# EAGLE design board (EAGLE 5.11)
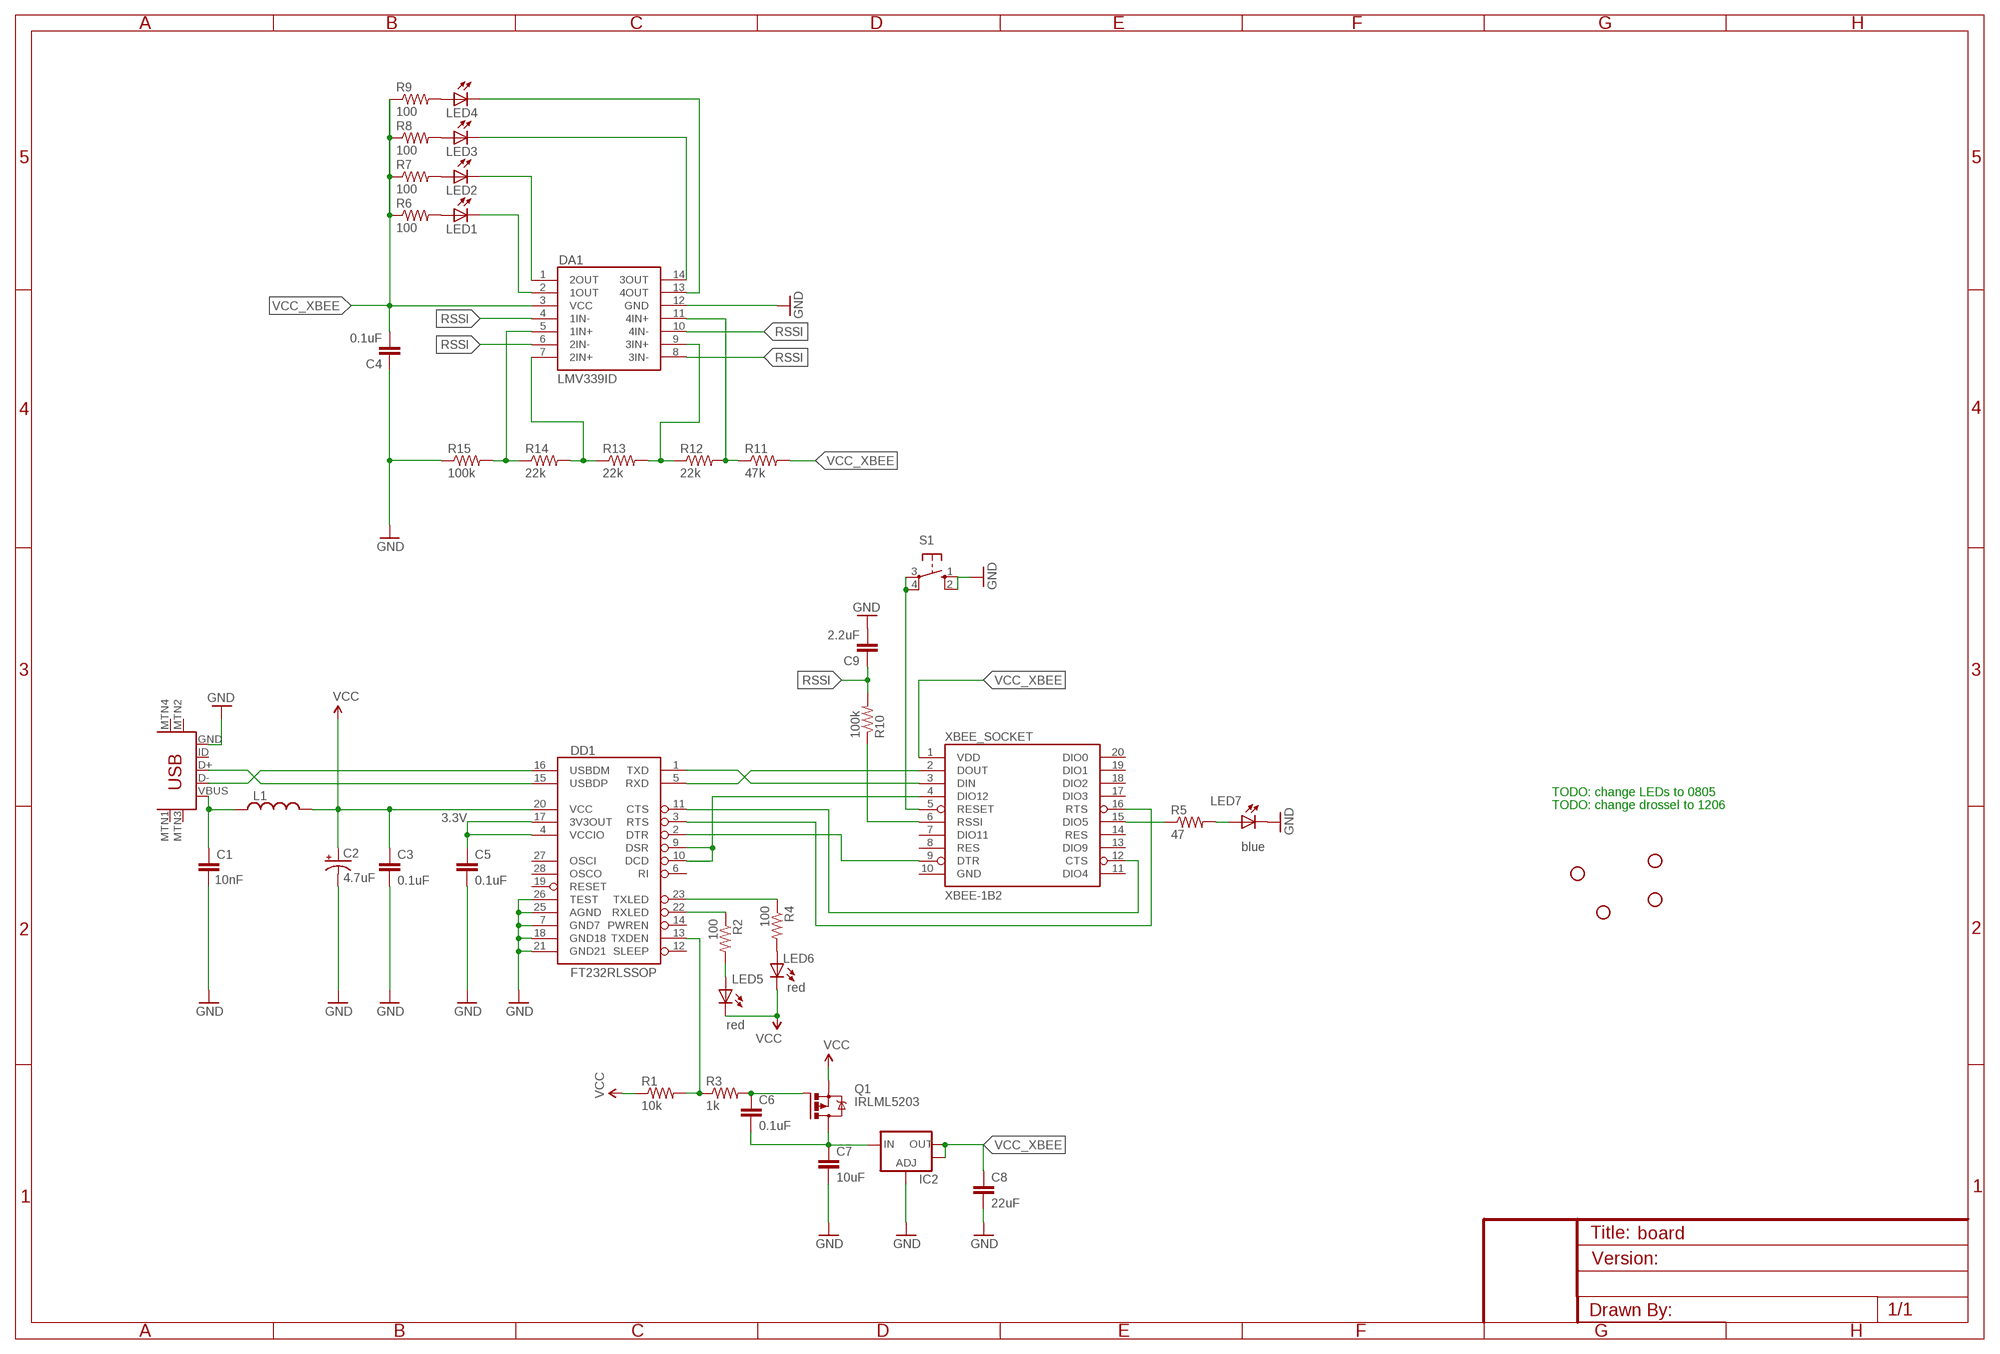
[diagram p0: schematic, sheet 1]

## Parts
C1  10nF  CAP0805  [0805]
C2  4.7uF  CAP_POL1206  [EIA3216]
C3  0.1uF  CAP0805  [0805]
C4  0.1uF  CAP0805  [0805]
C5  0.1uF  CAP0805  [0805]
C6  0.1uF  CAP0805  [0805]
C7  10uF  CAP1206  [1206]
C8  22uF  C-EUC1812  [C1812]
C9  2.2uF  CAP0805  [0805]
DA1  LMV339ID  [SO14]
DD1  FT232RLSSOP  [SSOP28DB]
IC2  V_REG_LM1117SOT223  [SOT223]
JP1  STAND-OFFTIGHT  [STAND-OFF-TIGHT]
JP2  STAND-OFFTIGHT  [STAND-OFF-TIGHT]
JP3  STAND-OFFTIGHT  [STAND-OFF-TIGHT]
JP4  STAND-OFFTIGHT  [STAND-OFF-TIGHT]
L1  L-USL3216C  [L3216C]
LED1  LED0603  [LED-0603]
LED2  LED0603  [LED-0603]
LED3  LED0603  [LED-0603]
LED4  LED0603  [LED-0603]
LED5  red  LED0805  [LED-0805]
LED6  red  LED0805  [LED-0805]
LED7  blue  LED0805  [LED-0805]
Q1  IRLML5203  [MICRO3]
R1  10k  RESISTOR0805-RES  [0805]
R2  100  RESISTOR0805-RES  [0805]
R3  1k  RESISTOR0805-RES  [0805]
R4  100  RESISTOR0805-RES  [0805]
R5  47  RESISTOR0805-RES  [0805]
R6  100  RESISTOR0805-RES  [0805]
R7  100  RESISTOR0805-RES  [0805]
R8  100  RESISTOR0805-RES  [0805]
R9  100  RESISTOR0805-RES  [0805]
R10  100k  RESISTOR0805-RES  [0805]
R11  47k  RESISTOR0805-RES  [0805]
R12  22k  RESISTOR0805-RES  [0805]
R13  22k  RESISTOR0805-RES  [0805]
R14  22k  RESISTOR0805-RES  [0805]
R15  100k  RESISTOR0805-RES  [0805]
S1  10-XX  [B3F-10XX]
U$1  USB-MINIB-5PIN  [USB-MINIB]
XBEE_SOCKET  XBEE-1B2  [XBEE-SILK]

## Nets
3.3V: C5.1 DD1.4(VCCIO) DD1.17(3V3OUT)
GND: C1.2 C2.C(-) C3.2 C4.1 C5.2 C7.2 C8.2 C9.2 DA1.12(GND) DD1.7(GND7) DD1.18(GND18) DD1.21(GND21) DD1.25(AGND) DD1.26(TEST) IC2.1(ADJ) LED7.C R15.1 S1.1(S) S1.2(S1) U$1.GND
N$1: DD1.15(USBDP) U$1.D+
N$2: DD1.16(USBDM) U$1.D-
N$3: DD1.1(TXD) XBEE_SOCKET.3(DIN)
N$4: LED1.A R6.2
N$5: DD1.5(RXD) XBEE_SOCKET.2(DOUT)
N$6: DD1.3(RTS) XBEE_SOCKET.16(RTS)
N$7: DD1.2(DTR) XBEE_SOCKET.9(DTR)
N$8: DD1.9(DSR) DD1.10(DCD) XBEE_SOCKET.4(DIO12)
N$9: DD1.11(CTS) XBEE_SOCKET.12(CTS)
N$10: DD1.23(TXLED) R4.1
N$11: DD1.22(RXLED) R2.1
N$12: LED6.A R4.2
N$13: LED5.A R2.2
N$14: DD1.13(TXDEN) R1.2 R3.1
N$15: R5.1 XBEE_SOCKET.15(DIO5)
N$16: LED7.A R5.2
N$17: C6.1 Q1.1(G) R3.2
N$18: C6.2 C7.1 IC2.3(IN) Q1.3(D)
N$19: S1.3(P) S1.4(P1) XBEE_SOCKET.5(RESET)
N$20: LED2.A R7.2
N$21: C1.1 L1.1 U$1.VBUS
N$22: LED3.A R8.2
N$23: LED4.A R9.2
N$24: R10.1 XBEE_SOCKET.6(RSSI)
N$25: DA1.11(4IN+) R11.1 R12.2
N$26: DA1.9(3IN+) R12.1 R13.2
N$27: DA1.7(2IN+) R13.1 R14.2
N$28: DA1.5(1IN+) R14.1 R15.2
N$29: DA1.13(4OUT) LED4.C
N$30: DA1.14(3OUT) LED3.C
N$31: DA1.1(2OUT) LED2.C
N$32: DA1.2(1OUT) LED1.C
RSSI: C9.1 DA1.4(1IN-) DA1.6(2IN-) DA1.8(3IN-) DA1.10(4IN-) R10.2
VCC: C2.A(+) C3.1 DD1.20(VCC) L1.2 LED5.C LED6.C Q1.2(S) R1.1
VCC_XBEE: C4.2 C8.1 DA1.3(VCC) IC2.2(OUT) IC2.4(OUT) R6.1 R7.1 R8.1 R9.1 R11.2 XBEE_SOCKET.1(VDD)
Unconnected: DD1.6(RI) DD1.12(SLEEP) DD1.14(PWREN) DD1.19(RESET) DD1.27(OSCI) DD1.28(OSCO) U$1.ID U$1.MTN1(MTN2) U$1.MTN2(MTN3) U$1.MTN3(MTN1) U$1.MTN4 XBEE_SOCKET.7(DIO11) XBEE_SOCKET.8(RES) XBEE_SOCKET.11(DIO4) XBEE_SOCKET.13(DIO9) XBEE_SOCKET.14(RES) XBEE_SOCKET.17(DIO3) XBEE_SOCKET.18(DIO2) XBEE_SOCKET.19(DIO1) XBEE_SOCKET.20(DIO0)

## Notes on the sheet
- TODO: change LEDs to 0805
- TODO: change drossel to 1206

## Power pins joined to a net without a drawn wire
GND: XBEE_SOCKET.10(GND)

## Library data of the parts
C1 C3-C7 C9 = SparkFun:CAP: Capacitor Standard 0603 ceramic capacitor, and 0.1" leaded capacitor.
C2 = SparkFun:CAP_POL: Capacitor Polarized These are standard SMD and PTH capacitors. Normally 10uF, 47uF, and 100uF in electrolytic and tantalum varieties. Always verify the external diameter of the through hole cap, it varies with capacity, voltage, and manufacturer. The EIA devices should be standard.
C8 = rcl:C-EU: CAPACITOR, European symbol
DA1 = barthess:LMV339
DD1 = SparkFun:FT232RL: USB UART FT232RL 4th Generation USB UART (USB <-> Serial) Controller. Spark Fun Electronics SKU : COM-00650
IC2 = SparkFun:V_REG_LM1117: Voltage Regulator LM1117 Standard adjustable voltage regulator but in SMD form. Spark Fun Electronics SKU : COM-00595
JP1-JP4 = SparkFun:STAND-OFF: Stand Off This is the mechanical footprint for a #4 phillips button head screw. Use the keepout ring to avoid running the screw head into surrounding components. SKU : PRT-00447
L1 = rcl:L-US: INDUCTOR, American symbol
LED1-LED4 = SparkFun:LED: LEDs Standard schematic elements and footprints for 5mm, 3mm, 1206, and 0603 sized LEDs. 5mm - Spark Fun Electronics SKU : COM-00529 (and others)
LED5-LED7 = barthess:LED: LEDs Standard schematic elements and footprints for 5mm, 3mm, 1206, and 0603 sized LEDs. 5mm - Spark Fun Electronics SKU : COM-00529 (and others)
Q1 = transistor-power:IRLML5203: HEXFET P-Channel Power MOSFET
R1-R15 = SparkFun:RESISTOR: Resistor Basic schematic elements and footprints for 0603, 1206, and PTH resistors.
S1 = switch-omron:10-XX: OMRON SWITCH; MPN: B3F-1000; OC_FARNELL: 176432; OC_NEWARK: 36M3542
U$1 = SparkFun:USB-MINIB: Mini-USB "B" connector with 5th pin broken out. Created new symbol breaking out 5th "ID" pin in mini/micro USB connector spec. See: http://en.wikipedia.org/wiki/Mini_usb#Cables. Uses same footprint as 4-pin symbol. Also added pins to connect to mounting / shield pads if required (probably not generally needed as signals aren't shielded once they leave the connector).
XBEE_SOCKET = barthess:XBEE-1

## Board
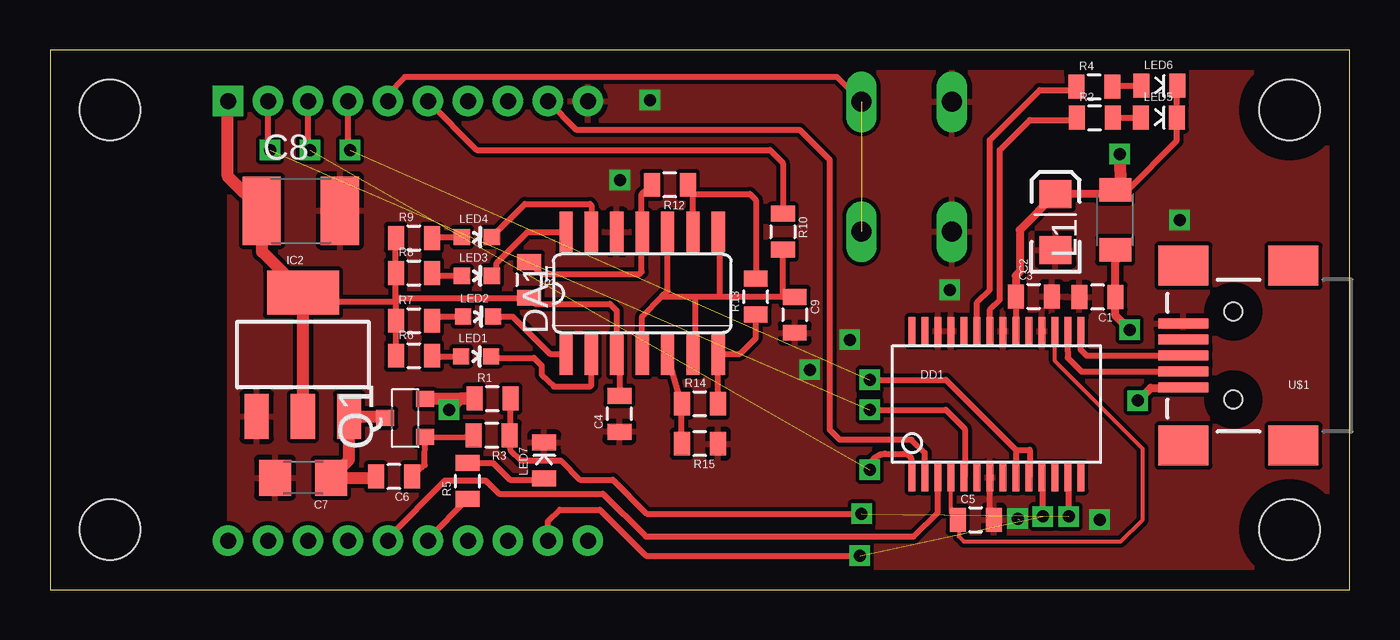
[diagram p1: board, top side]
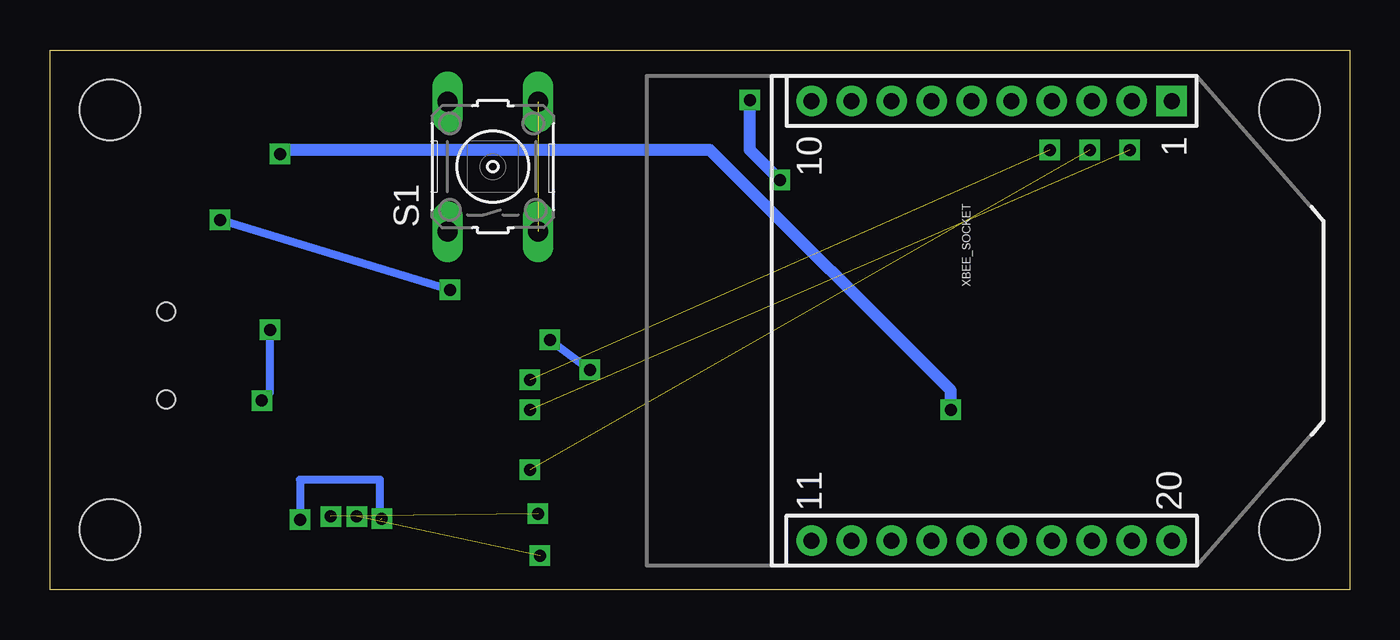
[diagram p2: board, bottom side, seen from below]

Size 65 x 27 mm. Coordinates in mm from the lower left corner, seen from the top.
Outline: 65,0 65,27 0,27 0,0 65,0
Copper layers (1*16): Top 0.035mm / dielectric 1.5mm / Bottom 0.035mm
Design rules "default *": minimum track width 10mil, minimum drill 24mil, track to track 8mil, track to pad 8mil, pad to pad 8mil, via to via 8mil, smd to smd 8mil, copper to edge 1mm, drill to drill 8mil, minimum pad ring 10mil, minimum via ring 8mil, stop-mask expansion 4mil, vias tented up to drill 0mil, thermal gap 10mil

### Footprints (pad centres in the part's own frame; a part is rotated, then mirrored left to right if it is on the bottom)
0805 = smd 0.8 x 1.2: 1 -0.9,0; 2 0.9,0
EIA3216 = smd 1.4 x 1.6: A 1.4,0; C -1.4,0
1206 = smd 1.6 x 1.8: 1 -1.4,0; 2 1.4,0
C1812 = smd 1.9 x 3.4: 1 -1.95,0; 2 1.95,0
SO14 = smd 0.66 x 2.032: 1 -3.81,-3.073; 2 -2.54,-3.073; 3 -1.27,-3.073; 4 0,-3.073; 5 1.27,-3.073; 6 2.54,-3.073; 7 3.81,-3.073; 8 3.81,3.073; 9 2.54,3.073; 10 1.27,3.073; 11 0,3.073; 12 -1.27,3.073; 13 -2.54,3.073; 14 -3.81,3.073
SSOP28DB = smd 0.348 x 1.397: 1 -4.225,-3.656; 2 -3.575,-3.656; 3 -2.925,-3.656; 4 -2.275,-3.656; 5 -1.625,-3.656; 6 -0.975,-3.656; 7 -0.325,-3.656; 8 0.325,-3.656; 9 0.975,-3.656; 10 1.625,-3.656; 11 2.275,-3.656; 12 2.925,-3.656; 13 3.575,-3.656; 14 4.225,-3.656; 15 4.225,3.656; 16 3.575,3.656; 17 2.925,3.656; 18 2.275,3.656; 19 1.625,3.656; 20 0.975,3.656; 21 0.325,3.656; 22 -0.325,3.656; 23 -0.975,3.656; 24 -1.625,3.656; 25 -2.275,3.656; 26 -2.925,3.656; 27 -3.575,3.656; 28 -4.225,3.656
SOT223 = smd 1.219 x 2.235: 1 -2.311,-3.099; 2 0,-3.099; 3 2.311,-3.099 | smd 3.6 x 2.2: 4 0,3.099
STAND-OFF-TIGHT = hole 3.048: 0,0
L3216C = smd 1.2 x 1.6: 1 -1.5,0; 2 1.5,0
LED-0603 = smd 0.8 x 0.8: A 0,-0.75; C 0,0.75
LED-0805 = smd 0.8 x 1.2: A -0.9,0; C 0.9,0
MICRO3 = smd 0.8 x 0.9: 1 -0.95,-1; 2 0.95,-1; 3 0,1
B3F-10XX = drill 1.016 long: 1 -3.251,2.261; 2 3.251,2.261; 3 -3.251,-2.261; 4 3.251,-2.261
USB-MINIB = smd 2.5 x 0.5: D+ 2.5,0; D- 2.5,0.8; GND 2.5,-1.6; ID 2.5,-0.8; VBUS 2.5,1.6 | smd 2.5 x 2: MTN1 -3,4.5; MTN2 2.5,4.5; MTN3 -3,-4.5; MTN4 2.5,-4.5 | hole 0.9: 0,2.2; 0,-2.2
XBEE-SILK = drill 0.8 pad 1.524 square: 1 -11,20 | drill 0.8 pad 1.524 round: 2 -11,18; 3 -11,16; 4 -11,14; 5 -11,12; 6 -11,10; 7 -11,8; 8 -11,6; 9 -11,4; 10 -11,2; 11 11,2; 12 11,4; 13 11,6; 14 11,8; 15 11,10; 16 11,12; 17 11,14; 18 11,16; 19 11,18; 20 11,20

### Placement (x,y rotation side)
C1  52.39,14.64 180 top
C2  50.29,18.39 90 top
C3  49.21,14.67 0 top
C4  28.48,8.8 90 top
C5  46.31,3.49 0 top
C6  17.21,5.66 180 top
C7  12.66,5.59 180 top
C8  12.55,18.95 0 top
C9  37.25,13.75 270 top
DA1  29.62,14.82 0 top
DD1  47.34,9.28 0 top
IC2  12.65,11.76 0 top
JP1  62,24 180 top
JP2  62,3 90 top
JP3  3,24 90 top
JP4  3,3 90 top
L1  53.28,18.5 90 top
LED1  21.32,11.67 270 top
LED2  21.4,13.66 270 top
LED3  21.35,15.7 270 top
LED4  21.35,17.64 270 top
LED5  55.47,23.62 0 top
LED6  55.48,25.21 0 top
LED7  24.72,6.46 90 top
Q1  17.77,8.58 90 top
R1  22.13,9.56 0 top
R2  52.25,23.61 0 top
R3  22.09,7.72 180 top
R4  52.23,25.16 0 top
R5  20.88,5.43 90 top
R6  18.2,11.7 0 top
R7  18.2,13.45 0 top
R8  18.2,15.85 0 top
R9  18.2,17.6 0 top
R10  36.65,17.9 270 top
R11  23.95,15.5 270 top
R12  31,20.25 180 top
R13  35.3,14.65 90 top
R14  32.5,9.3 0 top
R15  32.5,7.3 180 top
S1  42.85,21.16 90 bottom
U$1  59.19,11.71 180 top
XBEE_SOCKET  28.9,13.44 270 bottom

### Tracks (layer width: path | path; a pad name or v marks a point on that pad's centre or on a via)
3.3V
  Top 0.2: DD1.4 45.06,3.83 C5.1 45.45,3.45 45.45,2.65 45.7,2.4 53.55,2.4 54.65,3.5 54.65,7.05 50.27,11.44 DD1.17
GND  (via drill 0.6)  (1 unrouted)
  Top 0.305: DD1.7 47,5.5 47,4 C5.2
  Bottom 0.406: v45,15 v56.5,18.5 | v52.5,3.5 52.5,5.5 48.5,5.5 48.5,3.5 | v38,11 v40,12.5
  Bottom 0.61: v28.5,20.5 30,22 v30,24.5
  other vias: 48.4,3.55
  pour Top: 9,27 65,27 65,0 9,0
N$1
  Top 0.305: U$1.D+ 51.84,11.71 51.55,12 51.55,12.92 DD1.15
N$2
  Top 0.305: U$1.D- 51.59,10.91 50.9,11.6 50.9,11.92 DD1.16
N$3  (via drill 0.6)  (1 unrouted)
  Top 0.305: XBEE_SOCKET.3 12.9,22.1 v13,22 | DD1.1 43.11,6.39 arc90 42.7,6.8 41.8,6.8 arc90 v41,6
N$4
  Top 0.305: LED1.A 19.13,11.67 R6.2
N$5  (via drill 0.6)  (1 unrouted)
  Top 0.305: DD1.5 45.75,5.65 45.75,8.05 44.8,9 v41,9 | XBEE_SOCKET.2 10.9,22.1 v11,22
N$6
  Top 0.305: XBEE_SOCKET.16 16.9,2.6 19.75,5.45 21.8,5.45 22.45,4.8 27.65,4.8 29.8,2.65 43.2,2.65 44.4,3.85 44.4,5.6 DD1.3
N$7
  Top 0.305: XBEE_SOCKET.9 26.34,23 37.5,23 39,21.5 39,8 39.5,7.5 43.1,7.5 43.75,6.85 43.75,5.63 DD1.2
N$8  (via drill 0.6)  (1 unrouted)
  Top 0.305: DD1.10 49,5.65 49,7 48.3,7 | 48.3,7 48.31,6.98 DD1.9 48.3,5.63 48.3,7 | 48.3,7 44.8,10.5 v41,10.5 | XBEE_SOCKET.4 14.9,22.1 v15,22
N$9  (via drill 0.6)  (1 unrouted)
  Top 0.305: XBEE_SOCKET.12 24.9,3.4 25.5,4 27.5,4 29.8,1.7 v40.5,1.7 | DD1.11 49.65,5.58 v49.65,3.65
N$10
  Top 0.305: DD1.23 46.36,14.36 47,15 47,22.5 49.5,25 51.17,25 R4.1
N$11
  Top 0.305: DD1.22 47.02,14.02 47.5,14.5 47.5,22 49,23.5 51.24,23.5 R2.1
N$12
  Top 0.305: LED6.A 53.18,25.21 R4.2
N$13
  Top 0.305: LED5.A R2.2
N$14  (via drill 0.6)  (1 unrouted)
  Top 0.305: R1.2 23.03,8.13 R3.1 23.04,6.96 23.55,6.45 25.55,6.45 26.5,5.5 28.15,5.5 29.85,3.8 v40.6,3.8 | DD1.13 50.95,5.58 v50.95,3.65
N$15
  Top 0.305: XBEE_SOCKET.15 18.9,2.55 R5.1
N$16
  Top 0.305: R5.2 22.17,6.33 23,5.5 24.66,5.5 LED7.A
N$17
  Top 0.305: C6.1 18.74,6.23 Q1.1 20.78,7.62 R3.2
N$18
  Top 0.305: C6.2 16.54,6.09
  Top 0.61: C6.2 16.24,5.59 C7.1 14.96,6.49 IC2.3 16.69,8.66 Q1.3
N$19  (1 unrouted)
  Top 0.305: S1.4 39.35,25.65 17.75,25.65 16.9,24.8 XBEE_SOCKET.5
N$20
  Top 0.305: LED2.A 19.31,13.66 R7.2
N$21  (via drill 0.6)
  Top 0.406: U$1.VBUS 55.05,10.1 v54.4,9.45 | 53.3,16.56 C1.1 53.3,13.7 v54,13
  Top 0.61: 53.3,16.56 L1.1
  Bottom 0.406: v54.4,9.45 54,9.85 v54,13
N$22
  Top 0.305: LED3.A 19.25,15.7 R8.2
N$23
  Top 0.305: LED4.A 19.14,17.64 R9.2
N$24
  Top 0.305: R10.1 36.65,21.35 36,22 21.34,22 XBEE_SOCKET.6
N$25
  Top 0.305: 29.6,17.89 DA1.11 | 29.6,17.89 29.6,19.8 R12.2 | 29.6,17.89 29.6,15.9 29.5,15.8 24.55,15.8 R11.1
N$26
  Top 0.305: DA1.9 32.16,19.8 | 32.16,19.8 32.16,20.04 R12.1 | R13.2 35.3,19.5 35,19.8 32.16,19.8
N$27
  Top 0.305: R14.2 33.4,11.72 DA1.7 33.48,11.8 34.5,11.8 35.3,12.6 R13.1
N$28
  Top 0.305: DA1.5 R14.1 R15.2
N$29
  Top 0.305: DA1.13 27.08,19.22 27,19.3 23.76,19.3 LED4.C
N$30
  Top 0.305: DA1.14 23.89,17.89 22.35,16.35 22.35,15.95 LED3.C
N$31
  Top 0.305: LED2.C 23.14,13.66 25,11.8 25.76,11.8 DA1.1
N$32
  Top 0.305: DA1.2 27.08,10.23 27,10.15 25.2,10.15 24.6,10.75 24.6,11.2 24.2,11.6 22.14,11.6 LED1.C
RSSI
  Top 0.305: 36.65,14.65 C9.1 | 36.65,14.65 R10.2 | 30.6,14.65 32.25,14.65 | 32.25,14.65 33.5,14.65 | 33.5,14.65 36.65,14.65 | 30.6,14.65 29.62,13.67 DA1.4 | 30.6,14.65 30.89,14.94 DA1.10 | DA1.8 33.5,17.82 33.5,14.65 | DA1.6 32.25,11.84 32.25,14.65
VCC  (via drill 0.6)
  Top 0.305: Q1.2 19.3,9.56 | LED6.C LED5.C 56.35,23.6 56.35,22.45 53.9,20 53.53,20 L1.2 | DD1.20 C3.1
  Top 0.406: C3.1 48.31,15.71 48.5,15.9 48.5,18 C2.A 53.02,19.79 L1.2
  Top 0.61: 19.3,9.56 R1.1 20.51,9.56 v19.95,9 | v53.5,21.8 53.53,20
  Bottom 0.61: v53.5,21.8 53.3,22 32,22 19.95,9.95 v19.95,9
VCC_XBEE
  Top 0.305: 17.3,14.4 17.5,14.6 R11.2 24.25,14.3 28,14.3 28.35,13.95 DA1.3 28.48,11.62 C4.2 | R6.1 R7.1 17.3,14.4 | 17.3,14.4 R8.1 R9.1 | 17.3,14.4 13.11,14.4 IC2.4
  Top 0.6: IC2.4 10.6,16.91 C8.1 8.9,20.65 XBEE_SOCKET.1
  Top 0.61: IC2.2 IC2.4